# Altium schematic sheet CPU.SchDoc
size A4
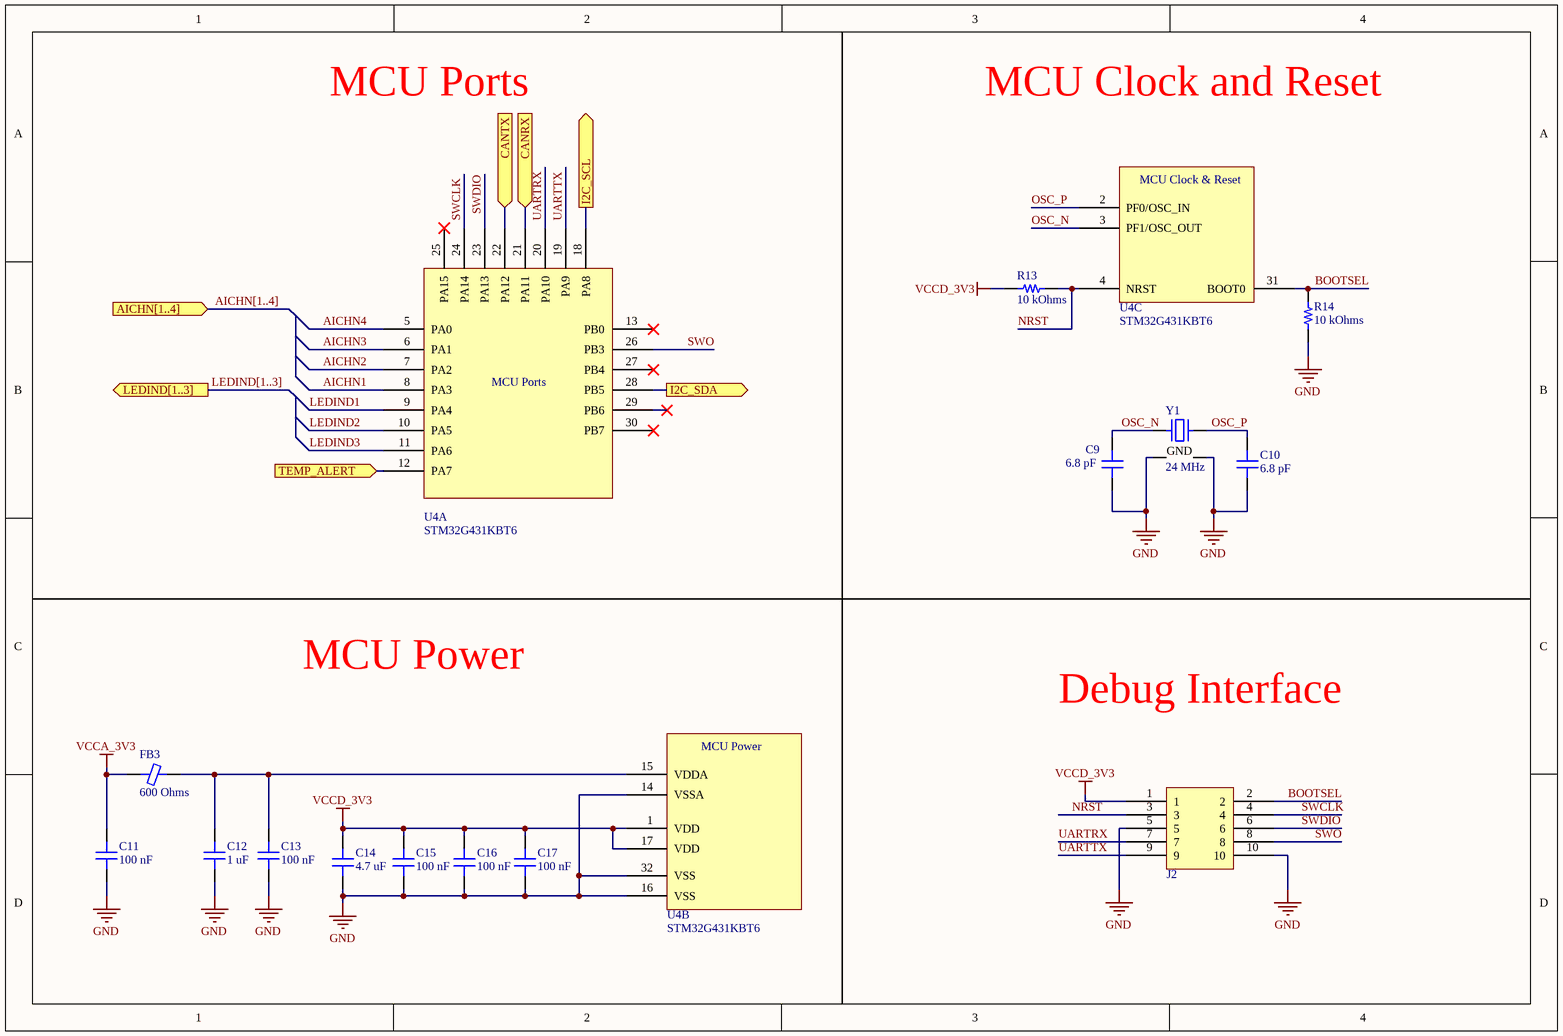
[diagram p0: CPU.SchDoc]

## Parts
C9  6.8 pF  [CAP 0603_1608]
C10  6.8 pF  [CAP 0603_1608]
C11  100 nF  [CAP 0603_1608]
C12  1 uF  [CAP 0603_1608]
C13  100 nF  [CAP 0603_1608]
C14  4.7 uF  [CAP 0603_1608]
C15  100 nF  [CAP 0603_1608]
C16  100 nF  [CAP 0603_1608]
C17  100 nF  [CAP 0603_1608]
FB3  600 Ohms  [FER 0805_2012]
J2  SHF-105-01-L-D-TH  [SHF-105-01-X-D-TH]  (value not drawn)
R13  10 kOhms  [RES 0603_1608]
R14  10 kOhms  [RES 0603_1608]
U4  STM32G431KBT6  [LQFP32ST]  (parts A,B,C of 3)
Y1  24 MHz  [ABM8G]

## Ports
AICHN[1..4] (in), CANRX (in), CANTX (in), I2C_SCL (out), I2C_SDA (out), LEDIND[1..3] (out), TEMP_ALERT (in)

## Nets
GND: C9.2 C10.2 C11.2 C12.1 C13.2 C14.1 C15.2 C16.2 C17.2 J2.5 J2.10 R14.2 U4.14(VSSA) U4.16(VSS) U4.32(VSS) Y1.2(GND) Y1.4(GND)
VCCA_3V3: C11.1 FB3.2
VCCD_3V3: C14.2 C15.1 C16.1 C17.1 J2.1 R13.1 U4.1(VDD) U4.17(VDD)
AICHN1: U4.8(PA3)
AICHN2: U4.7(PA2)
AICHN3: U4.6(PA1)
AICHN4: U4.5(PA0)
BOOTSEL: J2.2 R14.1 U4.31(BOOT0)
CANRX: U4.21(PA11) ; port CANRX
CANTX: U4.22(PA12) ; port CANTX
I2C_SCL: U4.18(PA8) ; port I2C_SCL
I2C_SDA: U4.28(PB5) ; port I2C_SDA
LEDIND1: U4.9(PA4)
LEDIND2: U4.10(PA5)
LEDIND3: U4.11(PA6)
NRST: J2.3 R13.2 U4.4(NRST)
OSC_N: C9.1 U4.3(PF1/OSC_OUT) Y1.1
OSC_P: C10.1 U4.2(PF0/OSC_IN) Y1.3
SWCLK: J2.4 U4.24(PA14)
SWDIO: J2.6 U4.23(PA13)
SWO: J2.8 U4.26(PB3)
TEMP_ALERT: U4.12(PA7) ; port TEMP_ALERT
UARTRX: J2.7 U4.20(PA10)
UARTTX: J2.9 U4.19(PA9)
NetC12_2: C12.2 C13.1 FB3.1 U4.15(VDDA)

Not connected (* = marked no-connect by the designer): U4 13(PB0)* 25(PA15)* 27(PB4)* 29(PB6)* 30(PB7)*

## Buses and harness runs
bus AICHN[1..4] = port AICHN[1..4]
bus LEDIND[1..3] = port LEDIND[1..3]

## Notes on the sheet
- MCU Ports
- MCU Clock and Reset
- MCU Power
- Debug Interface
- Title:
- Drawn By:
- Page Contents:
- Checked By:
- Size:
- Date:
- File:
- License:
- Email:
- A4
- Number:
- Time:
- Revision:
- Sheet
- Website:
- of
- (in symbol STM32G431KBT6, part A) MCU Ports
- (in symbol STM32G431KBT6, part B) MCU Power
- (in symbol STM32G431KBT6, part C) MCU Clock & Reset

## Library data of the parts
C9 C10 = 06035A6R8C4T4A: MLCC Ceramic 6.8 pF 50 V 0.25 pF Capacitor; Manufacturer: AVX; Tolerance: 0.25 pF; Voltage: 50 V; Type: capacitor_ceramic; Through Hole: 0; Part Number: 06035A6R8C4T4A; Value: 6.8 pF; Composition: NP0; Created On: 26/07/2020 23:31:19; Updated On: 26/07/2020 23:32:14; Package: 0603 (1608 Metric)
C11 C13 C15-C17 = 0603YC104KAT2A: MLCC Ceramic 100 nF 16 V 10% Capacitor; Manufacturer: AVX; Voltage: 16 V; Type: capacitor_ceramic; Through Hole: 0; Part Number: 0603YC104KAT2A; Value: 100 nF; Tolerance: 10%; Composition: X7R; Created On: 22/07/2020 19:09:12; Updated On: 22/07/2020 19:10:15; Package: 0603 (1608 Metric)
C12 = 0603YC105KAT2A: MLCC Ceramic 1 uF 16 V 10% Capacitor; Manufacturer: AVX; Voltage: 16 V; Type: capacitor_ceramic; Through Hole: 0; Part Number: 0603YC105KAT2A; Value: 1 uF; Tolerance: 10%; Composition: X7R; Created On: 26/07/2020 17:38:43; Updated On: 26/07/2020 17:39:03; Package: 0603 (1608 Metric)
C14 = GRM188Z71A475ME15D: MLCC Ceramic 4.7 uF 10 V 20% Capacitor; Manufacturer: Murata; Voltage: 10 V; Type: capacitor_ceramic; Through Hole: 0; Part Number: GRM188Z71A475ME15D; Value: 4.7 uF; Tolerance: 20%; Composition: X7R; Created On: 26/07/2020 16:11:28; Updated On: 26/07/2020 16:12:07; Package: 0603 (1608 Metric)
FB3 = BLM21SP601SH1D: Ferrite bead; Manufacturer: Murata Electronics; Number of Lines: 1; DC Resistance: 60 mOhms; Impedance Frequency: 600 Ohms @ 100 MHz; Current Rating: 1.5 A; Type: ferrite_bead; Through Hole: 0; Part Number: BLM21SP601SH1D; Value: 600 Ohms; Created On: 16/05/2020 11:32:40; Updated On: 16/05/2020 17:15:58; Package: 0805 (2012 Metric)
J2 = SHF-105-01-L-D-TH: Shrouded Terminal Strip, 0.050 pitch; Manufacturer: Samtec; Pitch: 50 mil; Voltage Rating: 300 V; Current Rating: 1 A; Number of Contacts: 10; Through Hole: 1; Part Number: SHF-105-01-L-D-TH; Orientation: straight; Number of Rows: 2; Created On: 31/05/2020 10:51:13; Updated On: 31/05/2020 10:51:32; Type: connector_pcb; Package: Through Hole
R13 R14 = CRCW060310K0FKEAC: Thin Film Resistor 10 kOhms 1%; Manufacturer: Vishay / Dale; Power Max: 100 mW; Through Hole: 0; Part Number: CRCW060310K0FKEAC; Value: 10 kOhms; Tolerance: 1%; Created On: 22/07/2020 22:08:22; Updated On: 22/07/2020 22:09:01; Type: resistor; Package: 0603 (1608 Metric)
U4 = STM32G431KBT6: STM32G431 ARM Cortex-M4  170MHz MCU; Manufacturer: STMicroelectronics; Core Size: 32 bits; Flash Size: 128 kB; RAM Size: 32 kB; Peripherals: ADC, DAC, Comparator, PGA, Temp, Timers; Connectivity: SPI, I2C, USART, USB, CAN, I2S; Voltage Supply: 3.3 V; Through Hole: 0; Part Number: STM32G431KBT6; Core: ARM Cortex-M4; Speed: 170 MHz; Created On: 22/05/2020 19:49:45; Updated On: 22/05/2020 19:55:34; Type: microcontroller; Package: LQFP32
Y1 = ABM8W-24.0000MHZ-8-B1U-T3: 24MHz 8pF -20C +70C 20ppm Crystal Oscillator; Manufacturer: ABRACON; Frquency Tolerance: 10 ppm; Through Hole: 0; Part Number: ABM8W-24.0000MHZ-8-B1U-T3; Value: 24 MHz; Load Capacitance: 8 pF; Frequency: 24 MHz; Created On: 24/05/2020 8:58:56; Updated On: 26/05/2020 19:01:38; Type: crystal_oscillator; Package: 4-SMD, No Lead